# Altium project Synth.PrjPcb
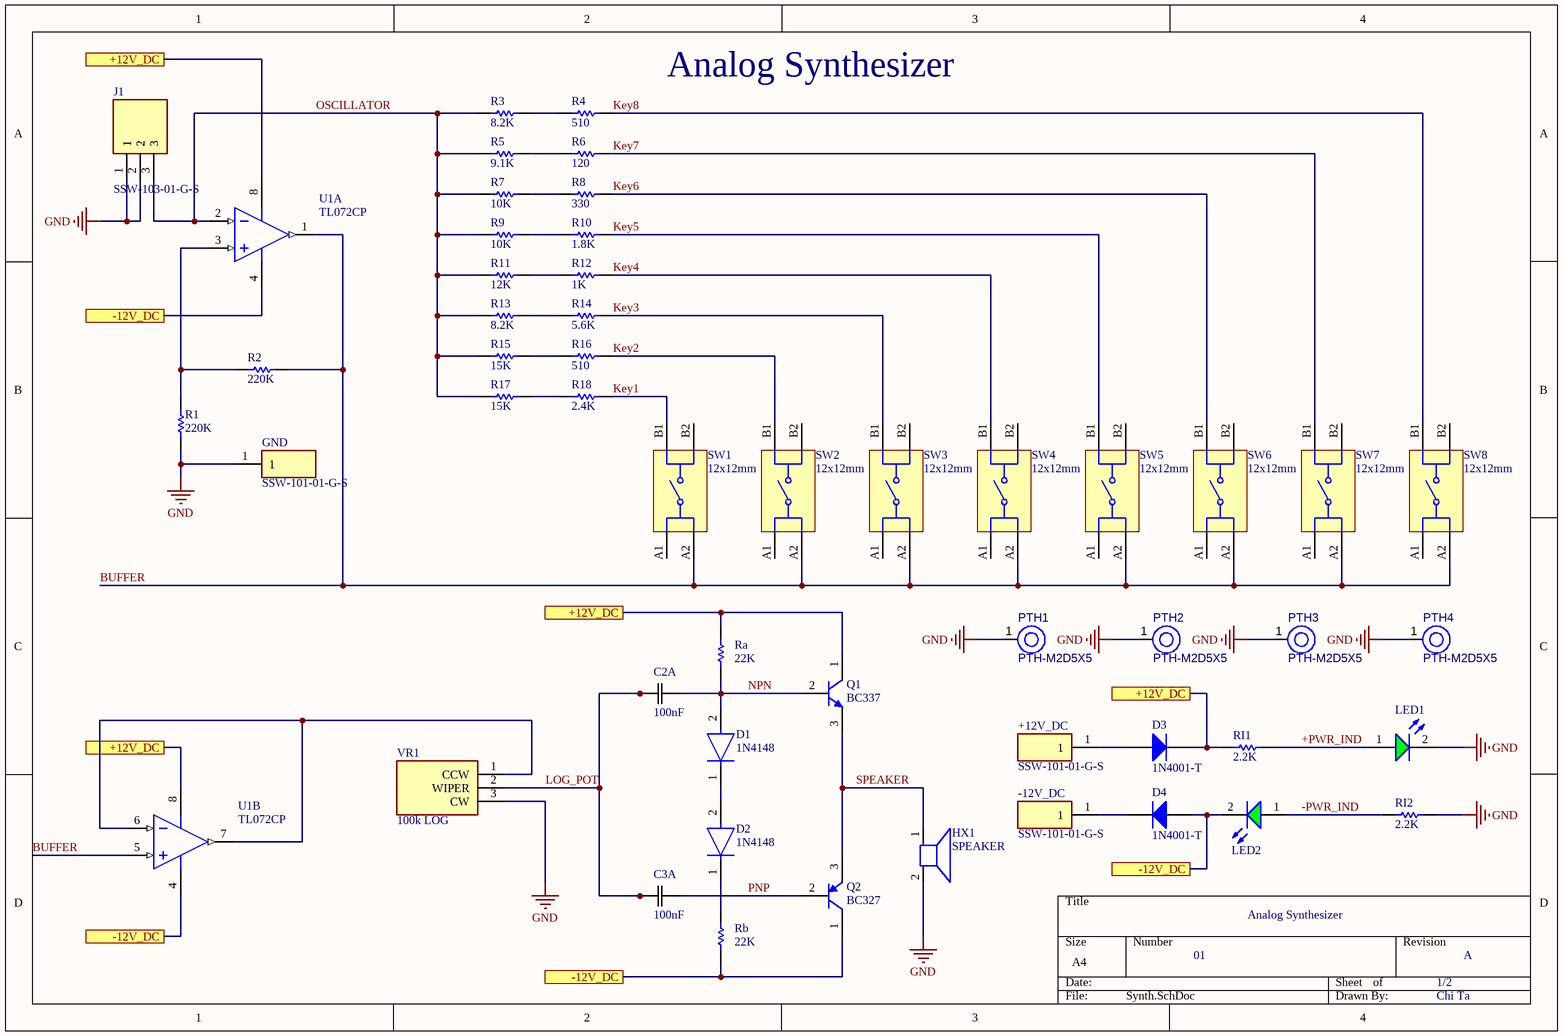
[diagram p0: Synth.SchDoc]
1 sheet, 51 parts. Net scope: flat (ports and power ports of the same name join across sheets).
Board file: Synth.PcbDoc

## Sheet Synth.SchDoc
size A4; SheetNumber: 1; SheetTotal: 1

### Parts
+12V_DC  SSW-101-01-G-S  [SSW-101-XX-YYY-S]
-12V_DC  SSW-101-01-G-S  [SSW-101-XX-YYY-S]
C2  100nF  [CAP_MKT1817_7p2x2p5x6p5-5_VIS]  (part A of 15)
C3  100nF  [CAP_MKT1817_7p2x2p5x6p5-5_VIS]  (part A of 15)
D1  1N4148  [FP-017AG-MFG]
D2  1N4148  [FP-017AG-MFG]
D3  1N4001-T  [DIOD-DO-41-P-2_V]
D4  1N4001-T  [DIOD-DO-41-P-2_V]
GND  SSW-101-01-G-S  [SSW-101-XX-YYY-S]
HX1  SPEAKER  [AL60P]
J1  SSW-103-01-G-S  [RHDR3W64P0X254_1X3_813X241X851P]
LED1  151031VS04000  [WL-TMRC_D3.95H5.3]  (value not drawn)
LED2  151031VS04000  [WL-TMRC_D3.95H5.3]  (value not drawn)
PTH1  PTH-M2D5X5  [PTH-M2D5X5]
PTH2  PTH-M2D5X5  [PTH-M2D5X5]
PTH3  PTH-M2D5X5  [PTH-M2D5X5]
PTH4  PTH-M2D5X5  [PTH-M2D5X5]
Q1  BC337  [ONSC-TO-92-3-29-11_AM_BL]
Q2  BC327  [ONSC-TO-92-3-29-11_AM_BL]
R1  220K  [RESA60-630X240]
R2  220K  [RESA60-630X240]
R3  8.2K  [RESA60-630X240]
R4  510  [RESA60-630X240]
R5  9.1K  [RESA60-630X240]
R6  120  [RESA60-630X240]
R7  10K  [RESA60-630X240]
R8  330  [RESA60-630X240]
R9  10K  [RESA60-630X240]
R10  1.8K  [RESA60-630X240]
R11  12K  [RESA60-630X240]
R12  1K  [RESA60-630X240]
R13  8.2K  [RESA60-630X240]
R14  5.6K  [RESA60-630X240]
R15  15K  [RESA60-630X240]
R16  510  [RESA60-630X240]
R17  15K  [RESA60-630X240]
R18  2.4K  [RESA60-630X240]
Ra  22K  [RESA60-630X240]
Rb  22K  [RESA60-630X240]
RI1  2.2K  [RESA60-630X240]
RI2  2.2K  [RESA60-630X240]
SW1  12x12mm  [4304x60857x6]
SW2  12x12mm  [4304x60857x6]
SW3  12x12mm  [4304x60857x6]
SW4  12x12mm  [4304x60857x6]
SW5  12x12mm  [4304x60857x6]
SW6  12x12mm  [4304x60857x6]
SW7  12x12mm  [4304x60857x6]
SW8  12x12mm  [4304x60857x6]
U1  TL072CP  [P0008A]  (parts A,B of 2)
VR1  100k LOG  [PDB181K420K104A2]

### Ports
+12V_DC (see Synth[1A], Synth[1C], Synth[2C]), +12V_DC (see Synth[1A], Synth[1C], Synth[3C]), +12V_DC (see Synth[1A], Synth[2C], Synth[3C]), +12V_DC (see Synth[1C], Synth[2C], Synth[3C]), -12V_DC (see Synth[1B], Synth[1D], Synth[2D]), -12V_DC (see Synth[1B], Synth[1D], Synth[3D]), -12V_DC (see Synth[1B], Synth[2D], Synth[3D]), -12V_DC (see Synth[1D], Synth[2D], Synth[3D])

### Nets
GND: GND.1 HX1.2(NEG) J1.1 J1.2 LED1.2(K) PTH1.1(H1) PTH2.1(H1) PTH3.1(H1) PTH4.1(H1) R1.1 RI2.1 VR1.3(CW)
+PWR_IND: LED1.1(A) RI1.2
-PWR_IND: LED2.1(A) RI2.2
BUFFER: R2.2 SW1.A2 SW2.A2 SW3.A2 SW4.A2 SW5.A2 SW6.A2 SW7.A2 SW8.A2 U1.1(OUT1) U1.5(IN2+)
Key1: R18.2 SW1.B1
Key2: R16.2 SW2.B1
Key3: R14.2 SW3.B1
Key4: R12.2 SW4.B1
Key5: R10.2 SW5.B1
Key6: R8.2 SW6.B1
Key7: R6.2 SW7.B1
Key8: R4.2 SW8.B1
LOG_POT: C2.1 C3.1 VR1.2(WIPER)
NPN: C2.2 D1.2(A) Q1.2(B) Ra.1
OSCILLATOR: J1.3 R3.1 R5.1 R7.1 R9.1 R11.1 R13.1 R15.1 R17.1 U1.2(IN1-)
PNP: C3.2 Q2.2(B)
SPEAKER: HX1.1(POS) Q1.3(E) Q2.3(E)
Net+12V_DC_1: +12V_DC.1 D3.1(A)
Net-12V_DC_1: -12V_DC.1 D4.2(K)
NetD1_1: D1.1(C) D2.2(A)
NetD2_1: D2.1(C) Rb.2
NetD3_2: D3.2(K) Q1.1(C) Ra.2 RI1.1 U1.8(VCC+) ; port +12V_DC
NetD4_1: D4.1(A) LED2.2(K) Q2.1(C) Rb.1 U1.4(VCC-) ; port -12V_DC
NetR1_2: R1.2 R2.1 U1.3(IN1+)
NetR3_2: R3.2 R4.1
NetR5_2: R5.2 R6.1
NetR7_2: R7.2 R8.1
NetR9_2: R9.2 R10.1
NetR11_2: R11.2 R12.1
NetR13_2: R13.2 R14.1
NetR15_2: R15.2 R16.1
NetR17_2: R17.2 R18.1
NetU1_6: U1.6(IN2-) U1.7(OUT2) VR1.1(CCW)

Not connected (* = marked no-connect by the designer): SW1 A1 B2; SW2 A1 B2; SW3 A1 B2; SW4 A1 B2; SW5 A1 B2; SW6 A1 B2; SW7 A1 B2; SW8 A1 B2

### Notes on the sheet
- Analog Synthesizer
- 01
- 1/2
- A
- Chi Ta

### Library data of the parts
+12V_DC -12V_DC GND = SSW-101-01-G-S: Connector; Manufacturer_Name: SAMTEC; Datasheet Link: http://suddendocs.samtec.com/prints/ssw-1xx-xx-xxx-x-xx-xxx-xx-mkt.pdf; Height: 8.51mm; Manufacturer_Part_Number: SSW-101-01-G-S; Mouser Part Number: 200-SSW10101GS; Mouser Price/Stock: https://www.mouser.co.uk/ProductDetail/Samtec/SSW-101-01-G-S?qs=rU5fayqh%252BE20ZXdRgwMbIg%3D%3D; Arrow Part Number: SSW-101-01-G-S; Arrow Price/Stock: https://www.arrow.com/en/products/ssw-101-01-g-s/samtec
C2 C3 = CMP-001-00083-1: MKT1817410064W; Mfr_Name: Vishay; Type: Film Capacitors; Source: MKT1817410064W.SchLib; Design Item ID: MKT1817410064W
D1 D2 = CMP-07163-000046-1: DIODE GEN PURP 100V 200MA DO35; Forward Voltage: 1V; Max Power Dissipation: 500mW; Max Reverse Current: 5uA; Forward Current: 300mA; Current: 4A; Reverse Recovery Time: 4ns; Element Configuration: Single; Outside Diameter: 1.85mm; Capacitance: 4pF; Polarity: Standard; Max Forward Surge Current (Ifsm): 1A; Reverse Voltage: 100V; Output Current: 200mA; Average Rectified Current: 200mA; Diameter: 1.91mm; Max Repetitive Reverse Voltage (Vrrm): 100V; Current Rating: 200mA; Case/Package: DO-35; Lead Free: Lead Free; Number of Pins: 2; Recovery Time: 4ns; Packaging: Bulk; Contact Plating: Tin; Voltage: 100V; Mount: Through Hole; Max Surge Current: 4A; Package Quantity: 2000; Width: 1.91mm; Max Reverse Voltage (DC): 100V; Length: 4.56mm; Radiation Hardening: No; Power Dissipation: 500mW; Voltage Rating (DC): 100V; Peak Non-Repetitive Surge Current: 4A; REACH SVHC: No SVHC; Height: 4.56mm; Max Operating Temperature: 175°C; Series: -; Weight: 0.01lb; Min Operating Temperature: -65°C
D3 D4 = CMP-0639-00006-2: 1.0 A Rectifier, 15 pF, 50 V, -65 to 150 degC, 2-Pin DO-41 Plastic, RoHS, Tape and Reel; Manufacturer: Diodes Inc; VF (V): 1; CT (pF): 15; Max. IR (uA): 5; VRRM (V): 50; Max. IFSM (A): 30; RoHS: TRUE; Mounting Technology: Through Hole; PartNumber: 1N4001-T; ComponentLink2Description: Datasheet; DatasheetVersion: Rev. 8-2; Operating Temperature Range (degC): -65 to 150; Packing: Tape and Reel; PackageReference: DO-41-P-2; ComponentLink1URL: http://diodes.com/; PackageDescription: 2-Pin Axial Lead, Body 4.635 x 2.36 mm, Lead Spread 25.4 mm; ComponentLink2URL: http://diodes.com/datasheets/ds28002.pdf; Max. Average Rectified Current IO (A): 1; ComponentLink1Description: Manufacturer URL
HX1 = CMP-006-000000-1: 8 Ohms Low Profile Speaker 250mW 380Hz ~ 10kHz Top Round 93dB; MF: Texas Instruments; Design Item ID: SPEAKER; Value: *; Availability: Unavailable; Pin Count: 2; SnapEDA_Link: https://www.snapeda.com/parts/SPEAKER/Texas%20Instruments/view-part/2776836/?ref=snap; Package: WFBGA-12 Texas Instruments; Component Type: Standard; Price: None; MP: SPEAKER; Source: SnapEDAsch.SchLib
J1 = SSW-103-01-G-S: Connector; Manufacturer_Name: SAMTEC; Datasheet Link: http://suddendocs.samtec.com/prints/ssw-1xx-xx-xxx-x-xx-xxx-xx-mkt.pdf; Height: 8.51mm; Manufacturer_Part_Number: SSW-103-01-G-S; Mouser Part Number: 200-SSW10301GS; Mouser Price/Stock: https://www.mouser.co.uk/ProductDetail/Samtec/SSW-103-01-G-S?qs=rU5fayqh%252BE2RqqT6UA0Qew%3D%3D; Arrow Part Number: SSW-103-01-G-S; Arrow Price/Stock: https://www.arrow.com/en/products/ssw-103-01-g-s/samtec?region=europe
LED1 LED2 = CMP-1488-00001-2: NexarPartId: 29717804; Test Current: 20mA; Lens Size: 3mm; Peak Wavelength: 573nm; Color: Green; Max Reverse Voltage (DC): 5V; Forward Voltage: 2.1V; Forward Current: 100mA; Dominant Wavelength: 570nm; Lens Style: Circular, Diffused, Round; Viewing Angle: 40°; Luminous Intensity: 120mcd; REACH SVHC: Unknown; Mount: Through Hole; Width: 3mm; Case/Package: Radial; Packaging: Bulk; Height: 5.3mm; Wavelength: 570nm; RoHS: Compliant; Max Operating Temperature: 85°C; Length: 3mm; Number of Pins: 2; Min Operating Temperature: -40°C
PTH1-PTH4 = CMP-00028-00004-2: M2 PTH (2.5mm), 5mm pad; Pins: 1
Q1 = CMP-1048-01583-1: Amplifier Transistor, NPN Silicon, 3-Pin TO-92, Pb-Free, Ammo Box; PartNumber: BC337-40ZL1G; Manufacturer: On Semiconductor; IC Continuous (A): 0.8; ComponentLink2URL: http://www.onsemi.com/pub_link/Collateral/BC337-D.PDF; PackageReference: TO-92-3-29-11_AM_BL; ComponentLink1Description: Manufacturer URL; RoHS: TRUE; PackageVersion: Rev. AM; ComponentLink3URL: http://www.onsemi.com/pub_link/Collateral/MAC97-D.PDF; ComponentLink3Description: Package Specification; Packing: Ammo Box; DatasheetVersion: Rev. 8; Polarity: NPN; ComponentLink1URL: http://www.onsemi.com/; ComponentLink2Description: Datasheet; PackageDescription: 3-Pin Transistor Outline, Body 4.825 x 3.685 mm, Pitch 1.27 mm; Mounting Technology: Through Hole
Q2 = CMP-1048-01577-1: Amplifier Transistor, PNP Silicon, 3-Pin TO-92, Pb-Free, Ammo Box; Manufacturer: On Semiconductor; PartNumber: BC327-25ZL1G; IC Continuous (A): -0.8; ComponentLink2URL: http://www.onsemi.com/pub_link/Collateral/BC327-D.PDF; ComponentLink1Description: Manufacturer URL; PackageReference: TO-92-3-29-11_AM_BL; Polarity: PNP; ComponentLink1URL: http://www.onsemi.com/; ComponentLink3Description: Package Specification; PackageDescription: 3-Pin Transistor Outline, Body 4.825 x 3.685 mm, Pitch 1.27 mm; PackageVersion: Rev. AM; ComponentLink3URL: http://www.onsemi.com/pub_link/Collateral/MAC97-D.PDF; ComponentLink2Description: Datasheet; RoHS: TRUE; DatasheetVersion: Rev. 6; Mounting Technology: Through Hole; Packing: Ammo Box
R1-R18 Ra Rb RI1 RI2 = CMP-1659-00074-2: Axial Resistor, 10 KOhm, +/- 1%, 0.25 W, -55 to 155 degC, 2-Pin THD, RoHS, Bulk; Manufacturer: Yageo; Temperature Coefficient: 100ppm\/degreesC; Voltage Rating: 250V; Voltage Rating (DC): 200V; Resistance: 10KOhm; Max Power Dissipation: 250mW; Datasheet URL: http://www.yageo.com/documents/recent/Yageo%20LR_MFR_2013.pdf; Packaging: Bulk; RoHSCompliant: True; Mount: ThroughHole; Package Reference: MFR-25; Termination: Axial; Composition: MetalFilm; Number of Terminations: 2; Package Quantity: 200; Mounting Technology: ThroughHole; Length: 0.248inch; Max Operating Temperature: 155degC; Min Operating Temperature: -55degC; Datasheet Version: 04/2013; Lead Free: LeadFree; Manufacturer URL: http://www.yageo.com/; Tolerance: 1%; Power Rating: 250mW; Package Description: 2-Pin Axial Lead, Dia 2.4 mm, Body Length 6.3 mm; Military Standard: Not; Case\/Package: Axial
SW1-SW8 = CMP-1456-00009-2: NexarPartId: 31136480; Voltage Rating: 12V; Contact Current Rating: 50mA; Insulation Resistance: 100MΩ; Actuator Length: 5mm; Illumination Type: Illuminated, Non-Illuminated; Actuator Material: Liquid Crystal Polymer, Polymer; Mechanical Life: 500kcycles; Throw Configuration: SPST; Switch Function: Off-Mom; Switch Travel: 300µm; Contact Plating: Silver; Packaging: Bulk; Contact Material: Silver, Stainless Steel; Max Operating Temperature: 85°C; RoHS: Compliant; REACH SVHC: No SVHC; Height: 8.5mm; Current Rating: 50mA; Min Operating Temperature: -40°C; Mount: Through Hole; Termination: PC Pin
U1 = CMP-0017-00950-2: Dual Low-Noise JFET-Input General-Purpose Operational Amplifier, 7 to 36 V, 0 to 70 degC, 8-pin DIP (P8), Pb-Free (RoHS); Manufacturer: Texas Instruments; Sub Family: General Purpose Amplifier, High Supply Voltage Amplifier (>=30V); Total Supply Voltage(Max)(+5V is 5, +/-5V is 10): 36; Slew Rate(Typ)(V/us): 13; Vn at 1kHz(Typ)(nV/rtHz): 18; GBW(Typ)(MHz): 3; CMRR(Min)(dB): 70; Total Supply Voltage(Min)(+5V is 5, +/-5V is 10): 7; Vio (25C)(Max)(mV): 10; Rating: Catalog; IIB(Max)(pA): 200; Iq per channel(Max)(mA): 2.5; Number of Channels: 2; Mounting Technology: Through Hole; ComponentLink3Description: Package Specification; PartNumber: TL072CP; PackageVersion: 4040082/E, 04/2010; Eco-Plan: Pb-Free (RoHS); DatasheetVersion: SLOS080J; Offset Drift(Typ)(uV/C): 18; ComponentLink3URL: http://www.ti.com/litv/pdf/mpdi001b; PackageDescription: 8-Pin Plastic In-Line, Body 9.59 x 6.35 mm, Pitch 2.54 mm; Code_JEDEC: MS-001; ComponentLink2URL: http://www.ti.com/lit/ds/symlink/tl072.pdf; ComponentLink1Description: Manufacturer URL; ComponentLink2Description: Datasheet; ComponentLink1URL: http://www.ti.com/; PackageReference: P0008A
VR1 = PDB181-K420K-104A2: Variable Resistor PDB181-K420K-104A2; Manufacturer_Name: Bourns; Datasheet Link: https://www.bourns.com/docs/Product-Datasheets/PDB18.pdf; Height: 16.5mm; Manufacturer_Part_Number: PDB181-K420K-104A2; Mouser Part Number: 652-PDB181K420K104A2; Mouser Price/Stock: https://www.mouser.com/Search/Refine.aspx?Keyword=652-PDB181K420K104A2; Arrow Part Number: PDB181-K420K-104A2; Arrow Price/Stock: https://www.arrow.com/en/products/pdb181-k420k-104a2/bourns?region=nac